# EAGLE design sot23-5&6 (EAGLE 7.7.0)
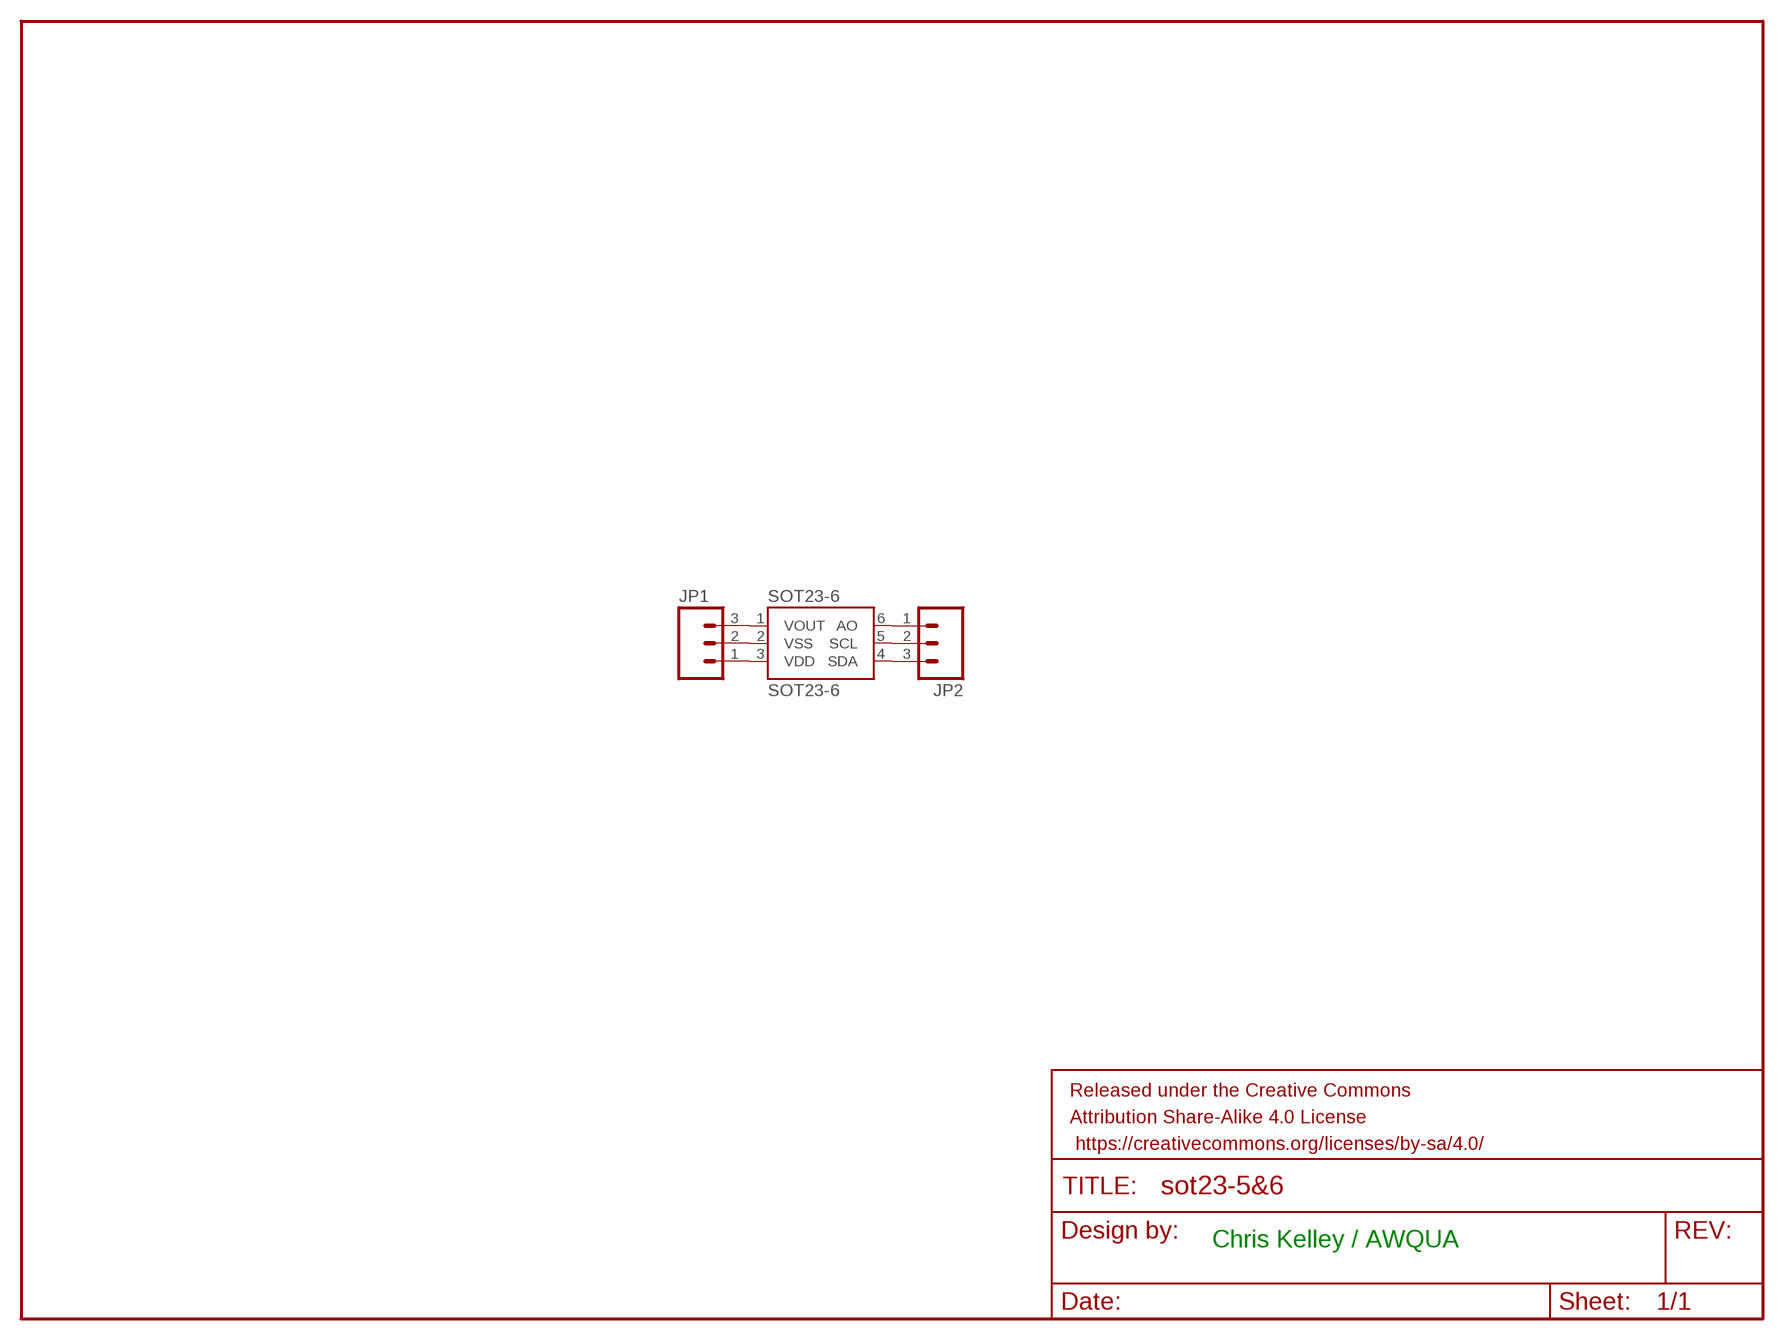
[diagram p0: schematic, sheet 1]

## Parts
FRAME1  FRAME-LETTER  [CREATIVE_COMMONS]
JP1  M03PTH  [1X03]
JP2  M03PTH  [1X03]
SOT23-6  SOT23-6  MCP4725SOT-23  [SOT23-6]

## Nets
N$1: JP1.1 SOT23-6.3(VDD)
N$2: JP1.2 SOT23-6.2(VSS)
N$3: JP1.3 SOT23-6.1(VOUT)
N$4: JP2.1 SOT23-6.6(AO)
N$5: JP2.2 SOT23-6.5(SCL)
N$6: JP2.3 SOT23-6.4(SDA)

## Notes on the sheet
- Chris Kelley / AWQUA

## Library data of the parts
FRAME1 = SparkFun-Aesthetics:FRAME-LETTER: Schematic Frame Standard 8.5x11 US Letter frame
JP1 JP2 = SparkFun-Connectors:M03: Header 3 Standard 3-pin 0.1" header. Use with straight break away headers (SKU : PRT-00116), right angle break away headers (PRT-00553), swiss pins (PRT-00743), machine pins (PRT-00117), and female headers (PRT-00115). Molex polarized connector foot print use with SKU : PRT-08232 with associated crimp pins and housings.
SOT23-6 = SparkFun-AnalogIC:MCP4725: Microchip 12-bit I2C DAC, SOT23-6; PROD_ID: IC-08886; VALUE: MCP4725

## Board
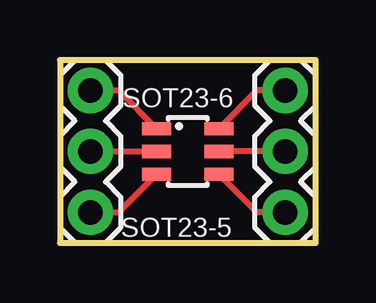
[diagram p1: board, top side]

Size 10.67 x 7.62 mm. Coordinates in mm from the lower left corner, seen from the top.
Outline: 0,0 10.67,0 10.67,7.62 0,7.62 0,0
Copper layers (1*16): Top 0.035mm / dielectric 1.5mm / Bottom 0.035mm
Design rules "default *": minimum track width 10mil, minimum drill 24mil, track to track 8mil, track to pad 8mil, pad to pad 8mil, via to via 8mil, smd to smd 8mil, copper to edge 40mil, drill to drill 8mil, minimum pad ring 10mil, minimum via ring 8mil, stop-mask expansion 4mil, vias tented up to drill 13mil, thermal gap 10mil

### Footprints (pad centres in the part's own frame; a part is rotated, then mirrored left to right if it is on the bottom)
1X03 = drill 1.016 pad 1.88: 1 0,0; 2 2.54,0; 3 5.08,0
SOT23-6 = smd 0.55 x 1.2: 1 0.95,1.3; 2 0,1.3; 3 -0.95,1.3; 4 -0.95,-1.3; 5 0,-1.3; 6 0.95,-1.3

### Placement (x,y rotation side)
FRAME1  16.51,-15.24 0 top  (outside the outline)
JP1  1.27,1.27 90 top
JP2  9.4,6.35 270 top
SOT23-6  5.33,3.81 90 top

### Tracks (layer width: path | path; a pad name or v marks a point on that pad's centre or on a via)
N$1
  Top 0.254: JP1.1 2.44,1.27 SOT23-6.3
N$2
  Top 0.254: JP1.2 SOT23-6.2
N$3
  Top 0.254: JP1.3 2.44,6.35 SOT23-6.1
N$4
  Top 0.254: JP2.1 8.22,6.35 SOT23-6.6
N$5
  Top 0.254: JP2.2 SOT23-6.5
N$6
  Top 0.254: JP2.3 8.22,1.27 SOT23-6.4

### Text on the board
tPlace: Chris Kelley / AWQUA
tNames: SOT23-5